# EAGLE design tiny13 (EAGLE 5.12)
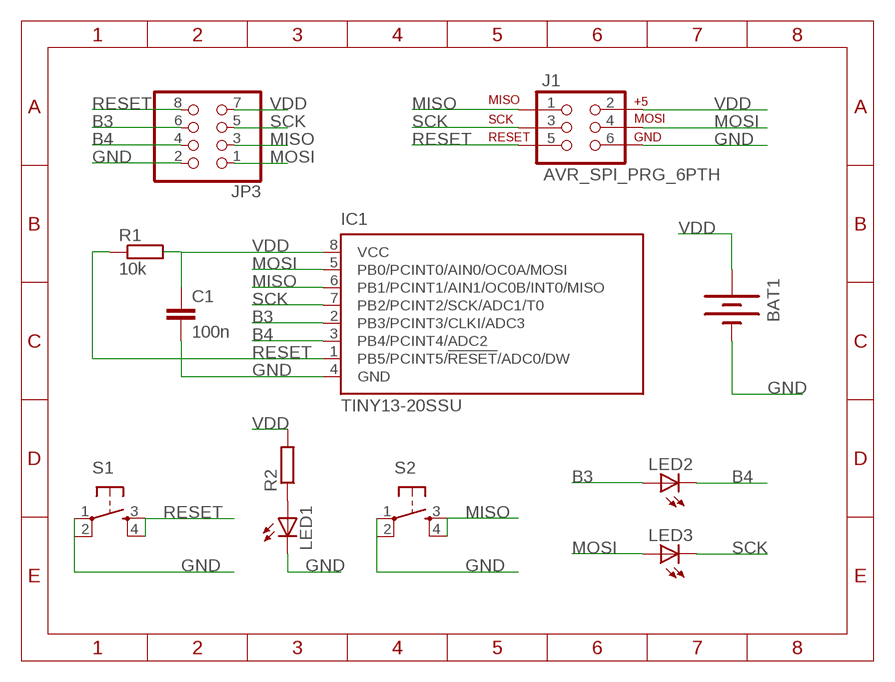
[diagram p0: schematic, sheet 1]

## Parts
BAT1  BATTERYFOB  [BATTERY_20MM_PTH_COMPACT]
C1  100n  C-EUC0603  [C0603]
IC1  TINY13-20SSU  [8S1]
J1  AVR_SPI_PRG_6PTH  [2X3]
JP3  PINHD-2X4  [2X04]
LED1  LEDCHIP-LED0805  [CHIP-LED0805]
LED2  LEDCHIP-LED0805  [CHIP-LED0805]
LED3  LEDCHIP-LED0805  [CHIP-LED0805]
R1  10k  R-EU_M0805  [M0805]
R2  R-EU_R0805  [R0805]
S1  TAC_SWITCHPTH  [TACTILE-PTH]
S2  TAC_SWITCHPTH  [TACTILE-PTH]

## Nets
B3: IC1.2(PB3/PCINT3/CLKI/ADC3) JP3.6 LED2.A
B4: IC1.3(PB4/PCINT4/ADC2) JP3.4 LED2.C
GND: BAT1.2(-) C1.2 IC1.4(GND) J1.6 JP3.2 LED1.C S1.1 S1.2 S2.1 S2.2
MISO: IC1.6(PB1/PCINT1/AIN1/OC0B/INT0/MISO) J1.1 JP3.3 S2.3 S2.4
MOSI: IC1.5(PB0/PCINT0/AIN0/OC0A/MOSI) J1.4 JP3.1 LED3.A
N$1: LED1.A R2.1
RESET: IC1.1(PB5/PCINT5/!RESET!/ADC0/DW) J1.5 JP3.8 R1.1 S1.3 S1.4
SCK: IC1.7(PB2/PCINT2/SCK/ADC1/T0) J1.3 JP3.5 LED3.C
VDD: BAT1.1(+) C1.1 IC1.8(VCC) J1.2 JP3.7 R1.2 R2.2

## Library data of the parts
BAT1 = SparkFun:BATTERY: Battery Holders Various common sizes : AA, AAA, 20mm coin cell and 12mm coin cell.
C1 = rcl:C-EU: CAPACITOR, European symbol
IC1 = atmel:TINY13: 8-bit AVR Microcontroller with 1K Bytes In-System Programmable Flash Source: http://www.atmel.com/dyn/resources/prod_documents/2535S.pdf; MPN: ATTINY13-20SSU; OC_FARNELL: 1455133; OC_NEWARK: 58M3771
J1 = SparkFun_ihsan:AVR_SPI_PRG_6: AVR ISP 6 Pin This is the reduced ISP connector for AVR programming. Common on Arduino. This footprint will take up less PCB space and can be used with a 10-pin to 6-pin adapter such as SKU: BOB-08508
JP3 = pinhead:PINHD-2X4: PIN HEADER
LED1-LED3 = adafruit:LED: LED OSRAM: - CHIPLED LG R971, LG N971, LY N971, LG Q971, LY Q971, LO R971, LY R971 LH N974, LH R974 LS Q976, LO Q976, LY Q976 LO Q996 - Hyper CHIPLED LW Q18S LB Q993, LB Q99A, LB R99A - SideLED LS A670, LO A670, LY A670, LG A670, LP A670 LB A673, LV A673, LT A673, LW A673 LH A674 LY A675 LS A676, LA A676, LO A676, LY A676, LW A676 LS A679, LY A679, LG A679 - Hyper Micro SIDELED® LS Y876, LA Y876, LO Y876, LY Y876 LT Y87S - SmartLED LW L88C, LW L88S LB L89C, LB L89S, LG L890 LS L89K, LO L89K, LY L89K LS L896, LA L896, LO L896, LY L896 - TOPLED LS T670, LO T670, LY T670, LG T670, LP T670 LSG T670, LSP T670, LSY T670, LOP T670, LYG T670 LG T671, LOG T671, LSG T671 LB T673, LV T673, LT T673, LW T673 LH T674 LS T676, LA T676, LO T676, LY T676, LB T676, LH T676, LSB T676, LW T676 LB T67C, LV T67C, LT T67C, LS T67K, LO T67K, LY T67K, LW E67C LS E67B, LA E67B, LO E67B, LY E67B, LB E67C, LV E67C, LT E67C LW T67C LS T679, LY T679, LG T679 LS T770, LO T770, LY T770, LG T770, LP T770 LB T773, LV T773, LT T773, LW T773 LH T774 LS E675, LA E675, LY E675, LS T675 LS T776, LA T776, LO T776, LY T776, LB T776 LHGB T686 LT T68C, LB T68C - Hyper Mini TOPLED® LB M676 - Mini TOPLED Santana® LG M470 LS M47K, LO M47K, LY M47K Source: http://www.osram.convergy.de/
R1 R2 = rcl:R-EU_: RESISTOR, European symbol
S1 S2 = SparkFun:TAC_SWITCH: Momentary Switch Button commonly used for reset or general input. Spark Fun Electronics SKU : COM-00097

## Board
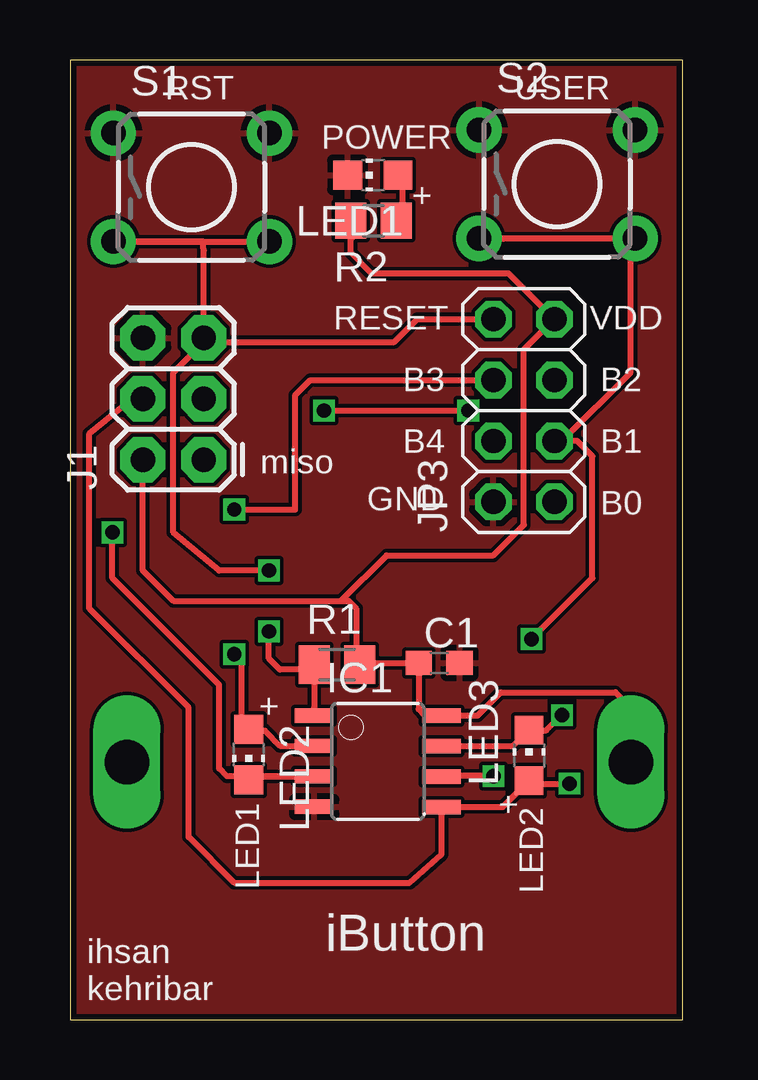
[diagram p1: board, top side]
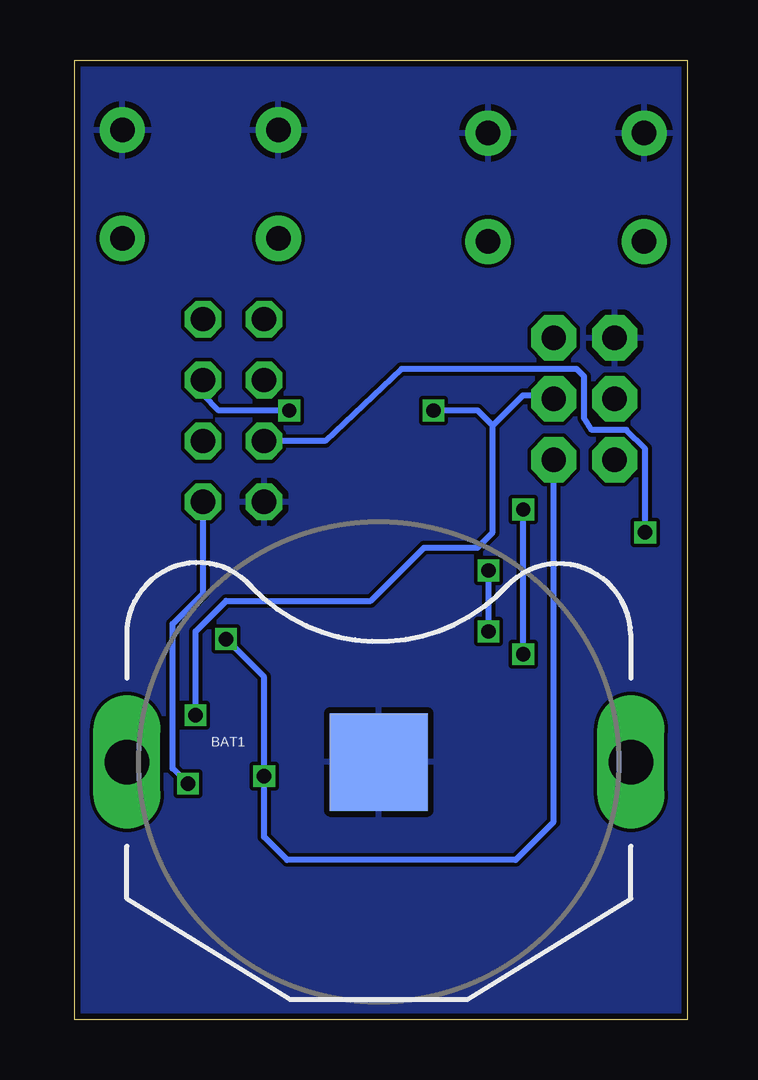
[diagram p2: board, bottom side, seen from below]

Size 25.52 x 40.01 mm. Coordinates in mm from the lower left corner, seen from the top.
Outline: 0,0 25.52,0 25.52,40.01 0,40.01 0,0
Copper layers (1*16): Top 0.035mm / dielectric 1.5mm / Bottom 0.035mm
Design rules "Fusion_eagle_rule_v1.1": minimum track width 6mil, minimum drill 12mil, track to track 6mil, track to pad 6mil, pad to pad 6mil, via to via 6mil, smd to smd 0mil, copper to edge 10mil, drill to drill 10mil, minimum pad ring 10mil, minimum via ring 6mil, stop-mask expansion 2mil, vias tented up to drill 100mil, thermal gap 10mil

### Footprints (pad centres in the part's own frame; a part is rotated, then mirrored left to right if it is on the bottom)
BATTERY_20MM_PTH_COMPACT = drill 1.854 long: 1 -10.5,0; 3 10.5,0 | smd 4.064 x 4.064: 2 0,0
C0603 = smd 1.1 x 1: 1 -0.85,0; 2 0.85,0
8S1 = smd 0.6 x 1.6: 1 -1.905,-2.654; 2 -0.645,-2.654; 3 0.625,-2.654; 4 1.895,-2.654; 5 1.905,2.654; 6 0.635,2.654; 7 -0.635,2.654; 8 -1.905,2.654
2X3 = drill 1.016 pad 1.88 octagon: 1 0,0; 2 0,2.54; 3 2.54,0; 4 2.54,2.54; 5 5.08,0; 6 5.08,2.54
2X04 = drill 1.016 octagon: 1 -3.81,-1.27; 2 -3.81,1.27; 3 -1.27,-1.27; 4 -1.27,1.27; 5 1.27,-1.27; 6 1.27,1.27; 7 3.81,-1.27; 8 3.81,1.27
CHIP-LED0805 = smd 1.2 x 1.2: A 0,-1.05; C 0,1.05
M0805 = smd 1.3 x 1.6: 1 -0.95,0; 2 0.95,0
R0805 = smd 1.3 x 1.5: 1 -0.95,0; 2 0.95,0
TACTILE-PTH = drill 1.016 pad 1.88 round: 1 -3.251,2.261; 2 3.251,2.261; 3 -3.251,-2.261; 4 3.251,-2.261

### Placement (x,y rotation side)
BAT1  12.86,10.75 0 bottom
C1  15.37,14.87 0 top
IC1  12.82,10.78 270 top
J1  5.57,23.35 90 top
JP3  18.9,25.4 90 top
LED1  12.61,35.22 90 top
LED2  7.44,11.06 180 top
LED3  19.12,11.02 0 top
R1  11.12,14.81 0 top
R2  12.64,33.31 180 top
S1  5.05,34.71 0 top
S2  20.29,34.84 0 top

### Tracks (layer width: path | path; a pad name or v marks a point on that pad's centre or on a via)
B3  (via drill 0.6)
  Top 0.254: IC1.2 8.74,11.43 8.12,12.06 7.16,12.07 | 7.16,12.07 7.16,14.92 v6.84,15.24 | v6.84,21.27 9.38,21.27 9.38,26.04 10.01,26.67 JP3.6 | 7.16,12.07 7.33,12.04 LED2.A
  Bottom 0.254: v6.84,15.24 v6.84,21.27
B4  (via drill 0.6)
  Top 0.254: LED2.C 7.44,10.15 IC1.3 6.53,10.15 6.2,10.48 6.2,13.97 1.76,18.42 v1.76,20.32
  Bottom 0.254: v1.76,20.32 1.76,23.81 2.54,24.59 3.98,24.59 4.3,25.08 4.3,26.82 4.62,27.13 11.92,27.13 15.09,24.13 JP3.4
GND
  pour Top: -2.22,-2.91 29.21,-2.91 29.21,41.54 -2.22,41.54 -2.22,-1.64
  pour Bottom: -3.81,-5.13 32.92,-5.3 32.92,42.96 -3.81,43.13
MISO  (via drill 0.6)
  Top 0.254: v17.63,10.16 15.84,10.16 IC1.6 | 18.08,32.58 S2.3 S2.4 23.35,32.53 23.35,26.99 20.49,24.13 JP3.3 21.13,24.13 21.76,23.5 21.76,18.42 v19.22,15.88
  Bottom 0.254: J1.1 5.57,8.26 7.16,6.67 16.68,6.67 17.63,7.62 v17.63,10.16 17.63,14.29 v19.22,15.88
MOSI  (via drill 0.6)
  Top 0.254: J1.4 2.57,25.89 0.81,24.45 0.81,17.15 4.93,13.02 4.93,7.62 6.84,5.72 14.14,5.72 15.48,6.9 IC1.5 18.02,8.87 LED3.A 19.25,9.84 v20.81,9.84
  Bottom 0.254: JP3.1 20.17,17.78 21.44,16.51 21.44,10.48 v20.81,9.84
N$1
  Top 0.254: LED1.A 13.86,34.97 13.86,33.76 R2.1
RESET  (via drill 0.6)
  Top 0.254: IC1.1 10.17,13.02 R1.1 9.97,14.61 8.74,14.61 8.28,15.07 v8.28,16.19 | S1.4 S1.3 5.53,32.45 5.57,32.07 J1.5 | J1.5 5.57,28.26 4.3,26.99 4.3,20.32 6.2,18.73 v8.28,18.73 | JP3.8 14.46,29.21 13.51,28.26 5.74,28.26 J1.5
  Bottom 0.254: v8.28,16.19 v8.28,18.73
SCK  (via drill 0.6)
  Top 0.254: IC1.7 18.46,11.41 LED3.C 19.85,12.07 v20.49,12.7 | v10.57,25.4 v16.59,25.4
  Bottom 0.254: v20.49,12.7 20.49,16.19 19.22,17.46 13.19,17.46 10.97,19.69 8.74,19.69 8.11,20.32 8.11,24.77 | 8.11,24.77 6.84,26.04 5.72,26.04 J1.3 | JP3.5 20.17,26.04 19.54,25.4 v16.59,25.4 | v10.57,25.4 8.74,25.4 8.11,24.77
VDD
  Top 0.254: BAT1.1 23.35,13.02 22.71,13.65 17.95,13.65 16.98,12.68 IC1.8 15.8,12.7 14.78,12.7 14.52,12.95 C1.1 12.13,14.87 R1.2 11.92,14.96 11.92,17.15 11.6,17.46 11.28,17.46 | J1.2 3.03,18.73 4.3,17.46 11.28,17.46 | 11.28,17.46 13.19,19.37 17.63,19.37 18.9,20.64 18.9,27.94 JP3.7 18.27,31.12 12.55,31.12 11.69,31.98 11.69,32.55 11.83,32.7 11.83,33.16 R2.2

### Text on the board
_tsilk: RST | USER | POWER | RESET | VDD | B3 | B2 | B4 | B1 | miso | GND | B0 | LED1 | LED2 | iButton | ihsan | kehribar